# Altium schematic sheet Main.SchDoc: Easy Inverter
size A4; Author: Hildo Guillardi Júnior; Organization: UNICAMP / LCEE; Address1: University of Campinas - Brazil; Address2: Power Conditioning Laboratory; Address3: Licensed by GNU GPL 3.0; PageSetup: Record=PageOptions|CenterHorizontal=True|CenterVertical=True|PrintScale=0.98|XCorrection=1.00|YCorrection=1.00|PrintKind=1|BorderSize=5000000|LeftOffset=0|BottomOffset=0|Orientation=2|PaperLength=1000|PaperWidth=1000|Scale=100|PaperSource=257|PrintQuality=600|MediaType=1|DitherType=10|PrintScaleMode=1|PaperKind=A4|PaperIndex=9; ProjectName: Easy Inverter
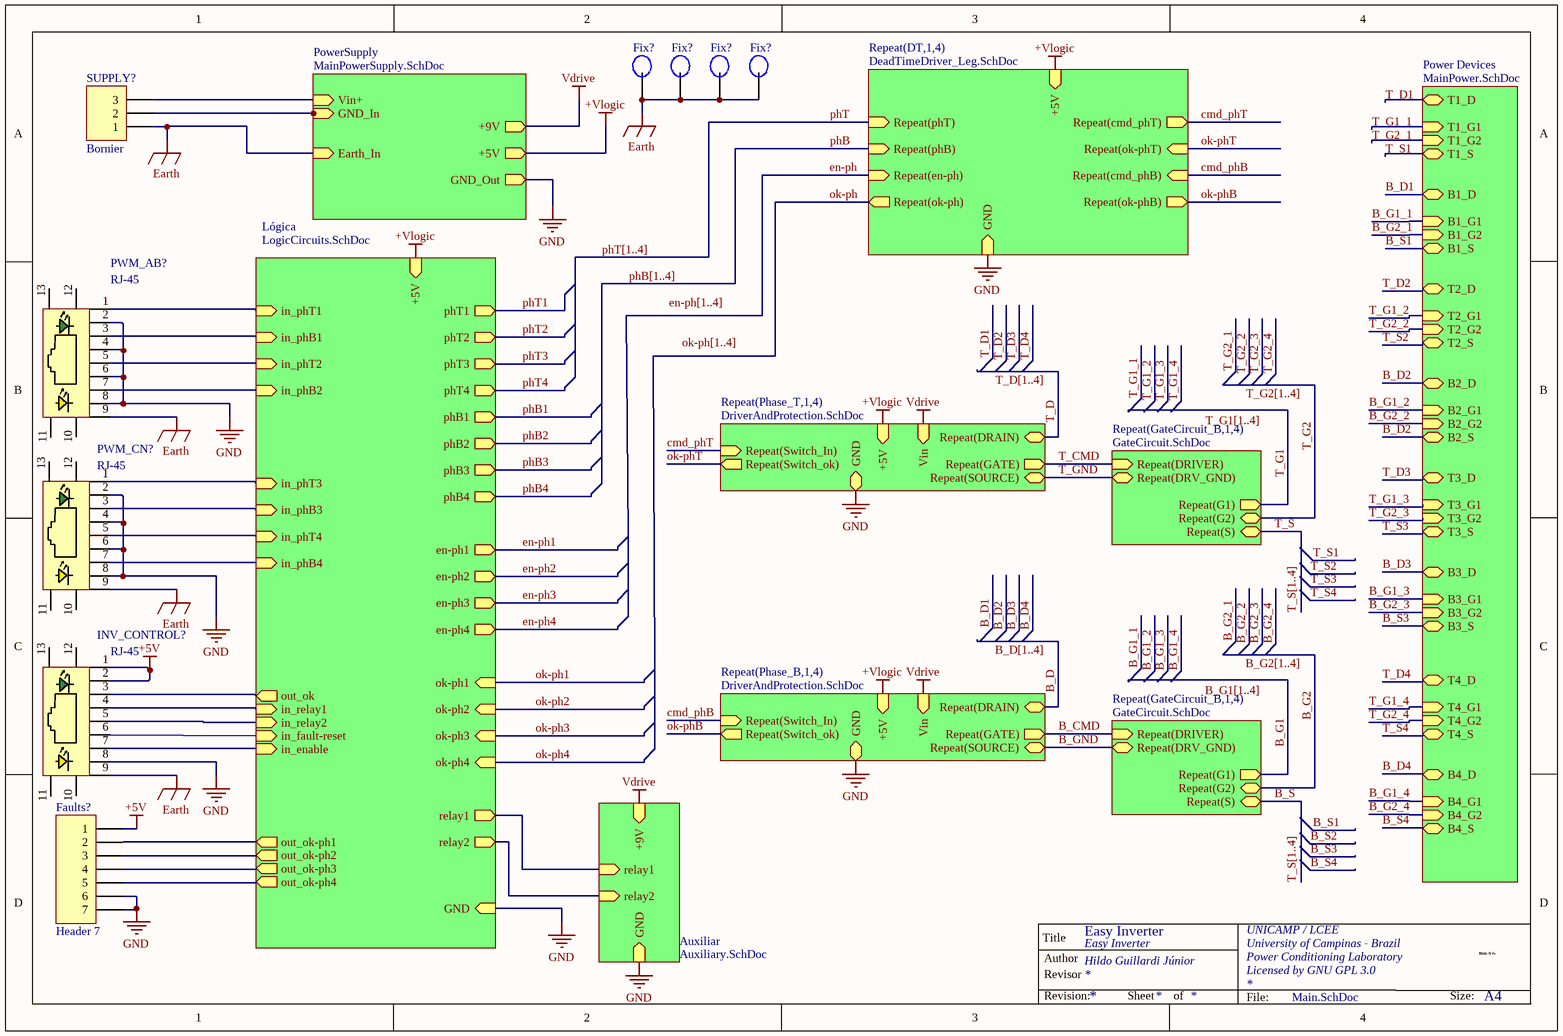
[diagram p0: Main.SchDoc]

## Parts
(Parts that share a designator on the sheet are numbered #1, #2 ... from top to bottom, then left to right.)
Faults?  value Header 7  [HDR1X7]
Fix?#1  (no value)  [Pino]
Fix?#2  (no value)  [Pino]
Fix?#3  (no value)  [Pino]
Fix?#4  (no value)  [Pino]
INV_CONTROL?  value RJ-45  [RJ-45]
PWM_AB?  value RJ-45  [RJ-45]
PWM_CN?  value RJ-45  [RJ-45]
SUPPLY?  value Bornier  [3 Pin  Borner]

## Sub-sheets
Auxiliar = Auxiliary.SchDoc: relay1 (in), relay2 (in), GND (in), +9V (in)
Lógica = LogicCircuits.SchDoc: +5V (in), GND (in), out_ok-ph1 (out), out_ok-ph2 (out), ok-ph1 (in), out_ok-ph3 (out), out_ok-ph4 (out), en-ph1 (out), en-ph2 (out), en-ph3 (out), en-ph4 (out), in_enable (in), in_fault-reset (in), in_relay1 (in), relay1 (out), relay2 (out), out_ok (out), ok-ph2 (in), ok-ph3 (in), ok-ph4 (in), phB1 (out), phB2 (out), phT1 (out), phT2 (out), phT3 (out), phB3 (out), phT4 (out), phB4 (out), in_phT1 (in), in_phB1 (in), in_phT2 (in), in_phB2 (in), in_phT4 (in), in_phB4 (in), in_phT3 (in), in_phB3 (in), in_relay2 (in)
Power Devices = MainPower.SchDoc: T1_D (bidir), T1_S (bidir), T1_G1 (in), T1_G2 (in), B1_D (bidir), B1_S (bidir), B1_G1 (in), B1_G2 (in), T2_D (bidir), T2_S (bidir), T2_G1 (in), T2_G2 (in), B2_D (bidir), B2_S (bidir), B2_G1 (in), B2_G2 (in), T3_D (bidir), T3_S (bidir), T3_G1 (in), T3_G2 (in), B3_D (bidir), B3_S (bidir), B3_G1 (in), B3_G2 (in), T4_D (bidir), T4_S (bidir), T4_G1 (in), T4_G2 (in), B4_D (bidir), B4_S (bidir), B4_G1 (in), B4_G2 (in)
PowerSupply = MainPowerSupply.SchDoc: Earth_In (in), +9V (out), +5V (out), GND_Out (out), GND_In (in), Vin+ (in)
Repeat(DT,1,4) = DeadTimeDriver_Leg.SchDoc: Repeat(ok-ph) (out), Repeat(cmd_phT) (out), Repeat(phB) (in), Repeat(ok-phT) (in), Repeat(phT) (in), GND (in), +5V (in), Repeat(ok-phB) (out), Repeat(en-ph) (in), Repeat(cmd_phB) (in)
Repeat(GateCircuit_B,1,4) = GateCircuit.SchDoc: Repeat(G2), Repeat(S), Repeat(G1) (out), Repeat(DRIVER) (in), Repeat(DRV_GND) (bidir)
Repeat(GateCircuit_B,1,4) = GateCircuit.SchDoc: Repeat(G2), Repeat(S), Repeat(G1) (out), Repeat(DRIVER) (in), Repeat(DRV_GND) (bidir)
Repeat(Phase_B,1,4) = DriverAndProtection.SchDoc: Repeat(SOURCE), Repeat(DRAIN), Repeat(GATE) (out), Repeat(Switch_In) (in), Repeat(Switch_ok) (out), +5V (in), Vin (in), GND
Repeat(Phase_T,1,4) = DriverAndProtection.SchDoc: Repeat(SOURCE), Repeat(DRAIN), Repeat(GATE) (out), Repeat(Switch_In) (in), Repeat(Switch_ok) (out), +5V (in), Vin (in), GND

## Nets
+5V: Faults?.1 INV_CONTROL?.1 INV_CONTROL?.2
+Vlogic: sheet Repeat(Phase_T,1,4)/+5V, sheet Lógica/+5V, sheet Repeat(DT,1,4)/+5V, sheet PowerSupply/+5V, sheet Repeat(Phase_B,1,4)/+5V
Earth: Fix?#1.0 Fix?#2.0 Fix?#3.0 Fix?#4.0 INV_CONTROL?.9 PWM_AB?.9 PWM_CN?.9 SUPPLY?.1 ; sheet PowerSupply/Earth_In
GND: Faults?.6 Faults?.7 INV_CONTROL?.8 PWM_AB?.2 PWM_AB?.4 PWM_AB?.6 PWM_AB?.8 PWM_CN?.2 PWM_CN?.4 PWM_CN?.6 PWM_CN?.8 ; sheet Repeat(Phase_T,1,4)/GND, sheet Lógica/GND, sheet Auxiliar/GND, sheet Repeat(DT,1,4)/GND, sheet PowerSupply/GND_Out, sheet Repeat(Phase_B,1,4)/GND
Vdrive: sheet Repeat(Phase_T,1,4)/Vin, sheet Auxiliar/+9V, sheet PowerSupply/+9V, sheet Repeat(Phase_B,1,4)/Vin
B_CMD: sheet Repeat(Phase_B,1,4)/Repeat(GATE), sheet Repeat(GateCircuit_B,1,4)/Repeat(DRIVER)
B_D: sheet Repeat(Phase_B,1,4)/Repeat(DRAIN)
B_D1: sheet Power Devices/B1_D
B_D2: sheet Power Devices/B2_D, sheet Power Devices/B2_S
B_D3: sheet Power Devices/B3_D
B_D4: sheet Power Devices/B4_D
B_G1: sheet Repeat(GateCircuit_B,1,4)/Repeat(G1)
B_G1_1: sheet Power Devices/B1_G1
B_G1_2: sheet Power Devices/B2_G1
B_G1_3: sheet Power Devices/B3_G1
B_G1_4: sheet Power Devices/B4_G1
B_G2: sheet Repeat(GateCircuit_B,1,4)/Repeat(G2)
B_G2_1: sheet Power Devices/B1_G2
B_G2_2: sheet Power Devices/B2_G2
B_G2_3: sheet Power Devices/B3_G2
B_G2_4: sheet Power Devices/B4_G2
B_GND: sheet Repeat(Phase_B,1,4)/Repeat(SOURCE), sheet Repeat(GateCircuit_B,1,4)/Repeat(DRV_GND)
B_S: sheet Repeat(GateCircuit_B,1,4)/Repeat(S)
B_S1: sheet Power Devices/B1_S
B_S3: sheet Power Devices/B3_S
B_S4: sheet Power Devices/B4_S
cmd_phB: sheet Repeat(DT,1,4)/Repeat(cmd_phB), sheet Repeat(Phase_B,1,4)/Repeat(Switch_In)
cmd_phT: sheet Repeat(Phase_T,1,4)/Repeat(Switch_In), sheet Repeat(DT,1,4)/Repeat(cmd_phT)
en-ph: sheet Repeat(DT,1,4)/Repeat(en-ph)
en-ph1: sheet Lógica/en-ph1
en-ph2: sheet Lógica/en-ph2
en-ph3: sheet Lógica/en-ph3
en-ph4: sheet Lógica/en-ph4
ok-ph: sheet Repeat(DT,1,4)/Repeat(ok-ph)
ok-ph1: sheet Lógica/ok-ph1
ok-ph2: sheet Lógica/ok-ph2
ok-ph3: sheet Lógica/ok-ph3
ok-ph4: sheet Lógica/ok-ph4
ok-phB: sheet Repeat(DT,1,4)/Repeat(ok-phB), sheet Repeat(Phase_B,1,4)/Repeat(Switch_ok)
ok-phT: sheet Repeat(Phase_T,1,4)/Repeat(Switch_ok), sheet Repeat(DT,1,4)/Repeat(ok-phT)
phB: sheet Repeat(DT,1,4)/Repeat(phB)
phB1: sheet Lógica/phB1
phB2: sheet Lógica/phB2
phB3: sheet Lógica/phB3
phB4: sheet Lógica/phB4
phT: sheet Repeat(DT,1,4)/Repeat(phT)
phT1: sheet Lógica/phT1
phT2: sheet Lógica/phT2
phT3: sheet Lógica/phT3
phT4: sheet Lógica/phT4
T_CMD: sheet Repeat(Phase_T,1,4)/Repeat(GATE), sheet Repeat(GateCircuit_B,1,4)/Repeat(DRIVER)
T_D: sheet Repeat(Phase_T,1,4)/Repeat(DRAIN)
T_D1: sheet Power Devices/T1_D
T_D2: sheet Power Devices/T2_D
T_D3: sheet Power Devices/T3_D
T_D4: sheet Power Devices/T4_D
T_G1: sheet Repeat(GateCircuit_B,1,4)/Repeat(G1)
T_G1_1: sheet Power Devices/T1_G1
T_G1_2: sheet Power Devices/T2_G1
T_G1_3: sheet Power Devices/T3_G1
T_G1_4: sheet Power Devices/T4_G1
T_G2: sheet Repeat(GateCircuit_B,1,4)/Repeat(G2)
T_G2_1: sheet Power Devices/T1_G2
T_G2_2: sheet Power Devices/T2_G2
T_G2_3: sheet Power Devices/T3_G2
T_G2_4: sheet Power Devices/T4_G2
T_GND: sheet Repeat(Phase_T,1,4)/Repeat(SOURCE), sheet Repeat(GateCircuit_B,1,4)/Repeat(DRV_GND)
T_S: sheet Repeat(GateCircuit_B,1,4)/Repeat(S)
T_S1: sheet Power Devices/T1_S
T_S2: sheet Power Devices/T2_S
T_S3: sheet Power Devices/T3_S
T_S4: sheet Power Devices/T4_S
NetFaults?_2: Faults?.2 ; sheet Lógica/out_ok-ph1
NetFaults?_3: Faults?.3 ; sheet Lógica/out_ok-ph2
NetFaults?_4: Faults?.4 ; sheet Lógica/out_ok-ph3
NetFaults?_5: Faults?.5 ; sheet Lógica/out_ok-ph4
NetINV_CONTROL?_3: INV_CONTROL?.3 ; sheet Lógica/out_ok
NetINV_CONTROL?_4: INV_CONTROL?.4 ; sheet Lógica/in_relay1
NetINV_CONTROL?_5: INV_CONTROL?.5 ; sheet Lógica/in_relay2
NetINV_CONTROL?_6: INV_CONTROL?.6 ; sheet Lógica/in_fault-reset
NetINV_CONTROL?_7: INV_CONTROL?.7 ; sheet Lógica/in_enable
NetPWM_AB?_1: PWM_AB?.1 ; sheet Lógica/in_phT1
NetPWM_AB?_3: PWM_AB?.3 ; sheet Lógica/in_phB1
NetPWM_AB?_5: PWM_AB?.5 ; sheet Lógica/in_phT2
NetPWM_AB?_7: PWM_AB?.7 ; sheet Lógica/in_phB2
NetPWM_CN?_1: PWM_CN?.1 ; sheet Lógica/in_phT3
NetPWM_CN?_3: PWM_CN?.3 ; sheet Lógica/in_phB3
NetPWM_CN?_5: PWM_CN?.5 ; sheet Lógica/in_phT4
NetPWM_CN?_7: PWM_CN?.7 ; sheet Lógica/in_phB4
NetSUPPLY?_2: SUPPLY?.2 ; sheet PowerSupply/GND_In
NetSUPPLY?_3: SUPPLY?.3 ; sheet PowerSupply/Vin+
(unnamed): sheet Lógica/relay1, sheet Auxiliar/relay1
(unnamed): sheet Lógica/relay2, sheet Auxiliar/relay2

Not connected (* = marked no-connect by the designer): INV_CONTROL? 10 11 12 13; PWM_AB? 10 11 12 13; PWM_CN? 10 11 12 13

## Buses and harness runs
bus B_D[1..4]
bus B_G1[1..4]
bus B_G2[1..4]
bus en-ph[1..4]
bus ok-ph[1..4]
bus phB[1..4]
bus phT[1..4]
bus T_D[1..4]
bus T_G1[1..4]
bus T_G2[1..4]
bus T_S[1..4]

## Notes on the sheet
- Labels drawn without touching a wire or pin: B_G1[1..4], en-ph[1..4], ok-ph[1..4], T_G1[1..4], T_S[1..4]
- Title
- Author
- Revisor
- Hildo G Jr
- Revision:
- Sheet
- of
- File:
- Size:
- A4
- HGJr

## Library data of the parts
Faults? = Header 7: Header, 7-Pin
Fix?#1-Fix?#4 = Pino: Value: Pin; pn: 908-100; RM2X12MM 2701
INV_CONTROL? PWM_AB? PWM_CN? = RJ-45: pn: A-2004-2-4-LPS-N-R
SUPPLY? = Header 3: Header, 3-Pin; pn: 1935174